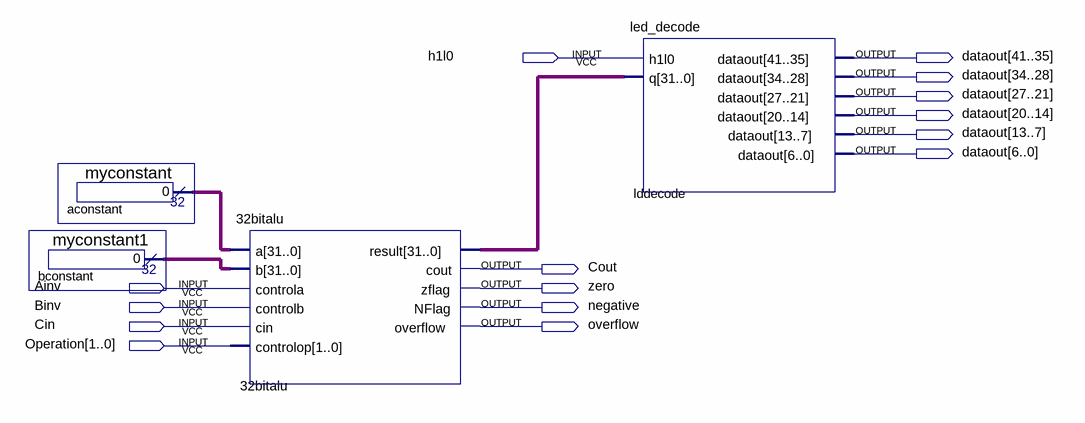
[diagram p0: schematic sheet]
// Quartus schematic Lab3.bdf as structural Verilog: 4 symbols, 15 pins
module Lab3 (
  input  h1l0,
  input  Ainv,
  input  Binv,
  input  Cin,
  input  [1:0] Operation,
  output [41:0] dataout,
  output Cout,
  output zero,
  output negative,
  output overflow
);

  wire [31:0] aconstant_result, bconstant_result, n32bitalu_result;

  myconstant aconstant (.result(aconstant_result));
  myconstant1 bconstant (.result(bconstant_result));
  \32bitalu  u_32bitalu (
    .a(aconstant_result), .b(bconstant_result), .controla(Ainv), .controlb(Binv), .cin(Cin),
    .controlop(Operation), .result(n32bitalu_result), .cout(Cout), .zflag(zero), .NFlag(negative),
    .overflow(overflow));
  led_decode lddecode (.h1l0(h1l0), .q(n32bitalu_result), .dataout(dataout));
endmodule
